# Altium schematic sheet LEDS_And_Buttons.SchDoc
size A4; SheetNumber: 4; SheetTotal: 6
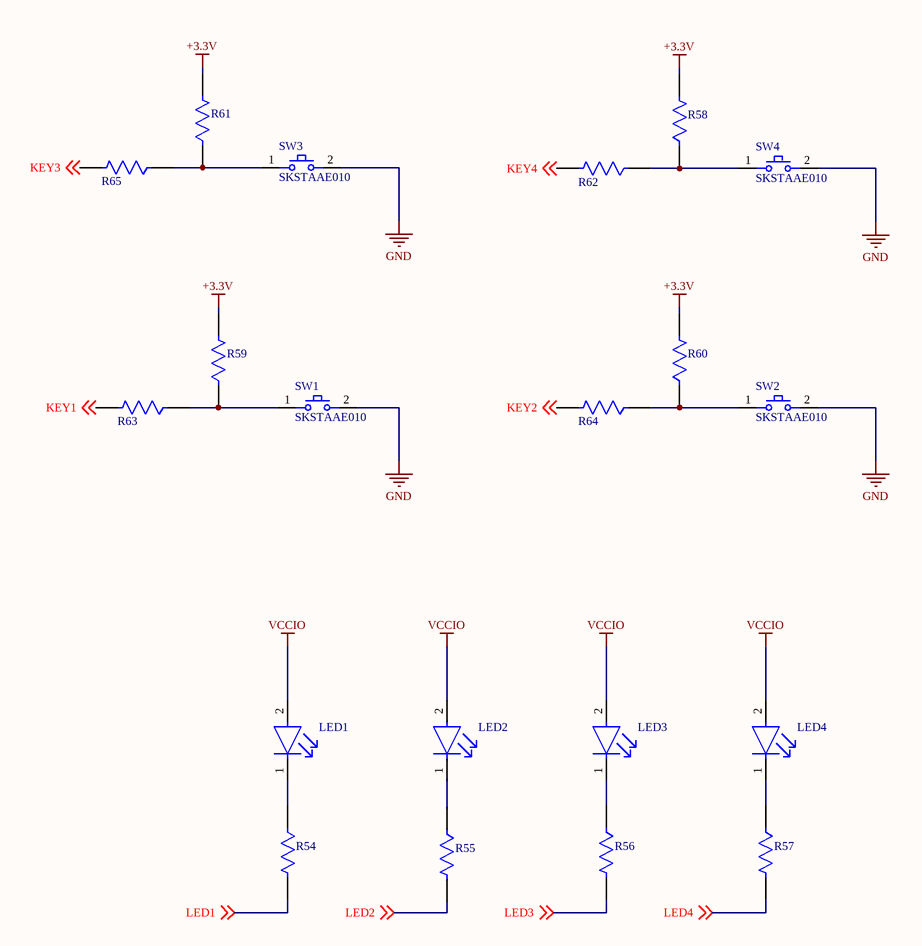
[diagram p0: LEDS_And_Buttons.SchDoc]

## Parts
LED1  LTST-C230EKT  [FP-LTST-C230EKT-MFG]  (value not drawn)
LED2  LTST-C230EKT  [FP-LTST-C230EKT-MFG]  (value not drawn)
LED3  LTST-C230EKT  [FP-LTST-C230EKT-MFG]  (value not drawn)
LED4  LTST-C230EKT  [FP-LTST-C230EKT-MFG]  (value not drawn)
R54  MCU0805MD4991BP100  [FP-MCU0805-MFG]  (value not drawn)
R55  MCU0805MD4991BP100  [FP-MCU0805-MFG]  (value not drawn)
R56  MCU0805MD4991BP100  [FP-MCU0805-MFG]  (value not drawn)
R57  MCU0805MD4991BP100  [FP-MCU0805-MFG]  (value not drawn)
R58  MCU0805MD4991BP100  [FP-MCU0805-MFG]  (value not drawn)
R59  MCU0805MD4991BP100  [FP-MCU0805-MFG]  (value not drawn)
R60  MCU0805MD4991BP100  [FP-MCU0805-MFG]  (value not drawn)
R61  MCU0805MD4991BP100  [FP-MCU0805-MFG]  (value not drawn)
R62  MCU0805MD4991BP100  [FP-MCU0805-MFG]  (value not drawn)
R63  MCU0805MD4991BP100  [FP-MCU0805-MFG]  (value not drawn)
R64  MCU0805MD4991BP100  [FP-MCU0805-MFG]  (value not drawn)
R65  MCU0805MD4991BP100  [FP-MCU0805-MFG]  (value not drawn)
SW1  SKSTAAE010  [FP-SKSTAAE010-MFG]
SW2  SKSTAAE010  [FP-SKSTAAE010-MFG]
SW3  SKSTAAE010  [FP-SKSTAAE010-MFG]
SW4  SKSTAAE010  [FP-SKSTAAE010-MFG]

## Nets
+3.3V: R58.2 R59.2 R60.2 R61.2
GND: SW1.2 SW2.2 SW3.2 SW4.2
VCCIO: LED1.2(A) LED2.2(A) LED3.2(A) LED4.2(A)
KEY1: R63.2 ; off-sheet KEY1
KEY2: R64.2 ; off-sheet KEY2
KEY3: R65.2 ; off-sheet KEY3
KEY4: R62.2 ; off-sheet KEY4
LED1: R54.2 ; off-sheet LED1
LED2: R55.2 ; off-sheet LED2
LED3: R56.2 ; off-sheet LED3
LED4: R57.2 ; off-sheet LED4
NetLED1_1: LED1.1(C) R54.1
NetLED2_1: LED2.1(C) R55.1
NetLED3_1: LED3.1(C) R56.1
NetLED4_1: LED4.1(C) R57.1
NetR58_1: R58.1 R62.1 SW4.1
NetR59_1: R59.1 R63.1 SW1.1
NetR60_1: R60.1 R64.1 SW2.1
NetR61_1: R61.1 R65.1 SW3.1

## Library data of the parts
LED1-LED4 = CMP-22017-000030-1: LED RED CLEAR CHIP SMD; Forward Current: 30mA; Test Current: 10mA; Number of Elements: 1; Viewing Angle: 130°; Dominant Wavelength: 621nm; Forward Voltage: 2V; Lens Style: Diffused; Power Rating: 100mW; Reverse Voltage: 5V; Wavelength: 630nm; Luminous Intensity: 6mcd; Lens Color: Colorless; Case/Package: 1206; Case Code (Imperial): 1206; Package Quantity: 1; Lead Free: Lead Free; Case Code (Metric): 3216; Height: 1.1mm; Lens Transparency: Clear; Mount: Surface Mount; Depth: 1.6mm; Number of LEDs: 1; Power Dissipation: 100mW; Max Operating Temperature: 85°C; Width: 1.6mm; Color: Red; Number of Pins: 2; Min Operating Temperature: -55°C; Packaging: Tape and Reel; Radiation Hardening: No; Illumination Color: Red; Length: 3.2mm
R54-R65 = CMP-02407-000217-1: RES 1.05K OHM 0.5% 1/5W 0805; Resistance: 4.99kR; Power Rating: 200mW; Tolerance: 0.1%; Voltage Rating: 150V; Weight: 0.000194oz; Package Quantity: 1000; Height: 0.52mm; Case Code (Imperial): 0805; Width: 1.25mm; Packaging: Tape and Reel; Case/Package: 0805; Length: 2mm; Composition: Thin Film; Termination: SMD/SMT; Min Operating Temperature: -55°C; Case Code (Metric): 2012; Max Operating Temperature: 155°C
SW1-SW4 = CMP-24311-000002-1: Tactile Switches Quiet 0.9mm Middle Stroke, 4N,500KCycle; Lead Free: Lead Free